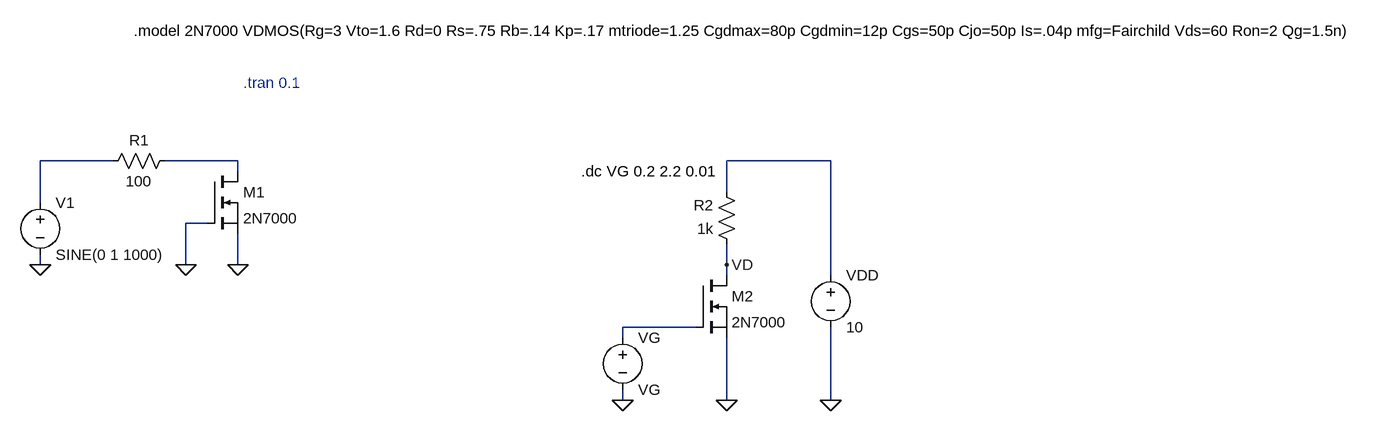
[diagram p0: schematic pre5.asc]
pre5.asc, the LTspice schematic file:
Version 4.1
SHEET 1 1888 680
WIRE -112 240 -224 240
WIRE 80 240 -32 240
WIRE 992 240 832 240
WIRE 80 256 80 240
WIRE 832 288 832 240
WIRE -224 304 -224 240
WIRE 32 336 0 336
WIRE -224 400 -224 384
WIRE 0 400 0 336
WIRE 80 400 80 352
WIRE 832 400 832 368
WIRE 832 416 832 400
WIRE 992 416 992 240
WIRE 784 496 672 496
WIRE 672 512 672 496
WIRE 672 608 672 592
WIRE 832 608 832 512
WIRE 992 608 992 496
FLAG 80 400 0
FLAG -224 400 0
FLAG 0 400 0
FLAG 832 400 VD
FLAG 832 608 0
FLAG 672 608 0
FLAG 992 608 0
SYMBOL nmos 32 256 R0
SYMATTR InstName M1
SYMATTR Value 2N7000
SYMBOL voltage -224 288 R0
WINDOW 123 0 0 Left 0
WINDOW 39 0 0 Left 0
SYMATTR InstName V1
SYMATTR Value SINE(0 1 1000)
SYMBOL res -16 224 R90
WINDOW 0 0 56 VBottom 2
WINDOW 3 32 56 VTop 2
SYMATTR InstName R1
SYMATTR Value 100
SYMBOL nmos 784 416 R0
SYMATTR InstName M2
SYMATTR Value 2N7000
SYMBOL voltage 672 496 R0
WINDOW 123 0 0 Left 0
WINDOW 39 0 0 Left 0
SYMATTR InstName VG
SYMATTR Value VG
SYMBOL res 848 384 R180
WINDOW 0 36 76 Left 2
WINDOW 3 36 40 Left 2
SYMATTR InstName R2
SYMATTR Value 1k
SYMBOL voltage 992 400 R0
SYMATTR InstName VDD
SYMATTR Value 10
TEXT -80 40 Left 2 !.model 2N7000 VDMOS(Rg=3 Vto=1.6 Rd=0 Rs=.75 Rb=.14 Kp=.17 mtriode=1.25 Cgdmax=80p Cgdmin=12p Cgs=50p Cjo=50p Is=.04p mfg=Fairchild Vds=60 Ron=2 Qg=1.5n)
TEXT 88 120 Left 2 ;.tran 0.1
TEXT 608 256 Left 2 !.dc VG 0.2 2.2 0.01

The netlist it stands for:
* pre5.asc
M1 N002 0 0 0 2N7000
V1 N001 0 SINE(0 1 1000)
R1 N002 N001 100
M2 VD N004 0 0 2N7000
VG N004 0 VG
R2 VD N003 1k
VDD N003 0 10
.model NMOS NMOS
.model PMOS PMOS
.lib standard.mos
.model 2N7000 VDMOS(Rg=3 Vto=1.6 Rd=0 Rs=.75 Rb=.14 Kp=.17 mtriode=1.25 Cgdmax=80p Cgdmin=12p Cgs=50p Cjo=50p Is=.04p mfg=Fairchild Vds=60 Ron=2 Qg=1.5n)
* .tran 0.1
.dc VG 0.2 2.2 0.01
.backanno
.end